# Altium schematic sheet PowerAmp.SchDoc
size A4; SheetNumber: 4; SheetTotal: 4
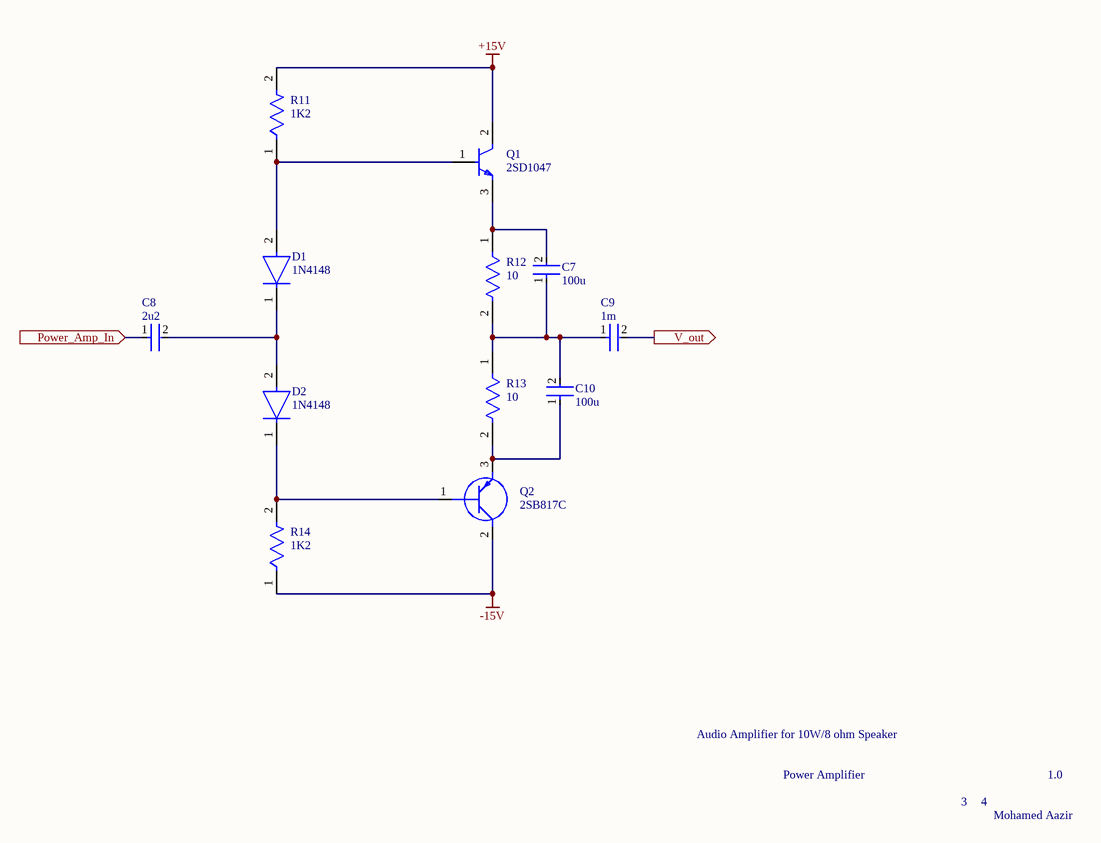
[diagram p0: PowerAmp.SchDoc]

## Parts
C7  100u  [FP-RAD-TH-D_5_0_5-L_11_1-MFG]
C8  2u2  [FP-RAD-TH-D_5_0_5-L_11_1-MFG]
C9  1m  [FP-RAD-TH-D_5_0_5-L_11_1-MFG]
C10  100u  [FP-RAD-TH-D_5_0_5-L_11_1-MFG]
D1  1N4148  [FP-017AG-MFG]
D2  1N4148  [FP-017AG-MFG]
Q1  2SD1047  [FP-2SD1047-MFG]
Q2  2SB817C  [TO545P500X1560X2380-3P]
R11  1K2  [FP-MFR-25-MFG]
R12  10  [FP-HVR37-MFG]
R13  10  [FP-HVR37-MFG]
R14  1K2  [FP-MFR-25-MFG]

## Ports
Power_Amp_In (in, see TopLevelDesign[2B], PreAmplifier_ToneController[4B]), V_out (out, see TopLevelDesign[3B], InputOutputPower[2B])

## Nets
+15V: Q1.2(C) R11.2
-15V: Q2.2(C) R14.1
Power_Amp_In: C8.1 ; port Power_Amp_In
V_out: C9.2 ; port V_out
NetC7_1: C7.1 C9.1 C10.2 R12.2 R13.1
NetC7_2: C7.2 Q1.3(E) R12.1
NetC8_2: C8.2 D1.1(C) D2.2(A)
NetC10_1: C10.1 Q2.3(E) R13.2
NetD1_2: D1.2(A) Q1.1(B) R11.1
NetD2_1: D2.1(C) Q2.1(B) R14.2

## Notes on the sheet
- Audio Amplifier for 10W/8 ohm Speaker
- Power Amplifier
- 3
- 4
- 1.0
- Mohamed Aazir

## Library data of the parts
C7-C10 = CMP-05427-002189-1: Aluminum Electrolytic Capacitors (Radial Lead Type) 22uF ±20% 25V; Dissipation Factor: 0.15%; Ripple Current: 60mA; Life (Hours): 2000Hour; Leakage Current: 3mA; Polarity: Bipolar; Lead Diameter: 0.5mm; Voltage Rating (DC): 25V; Capacitance: 22uF; Height: 11mm; Construction: RADIAL; Min Operating Temperature: -40°C; Tolerance: 20%; Max Operating Temperature: 85°C; Reach SVHC Compliant: Yes; Diameter: 5mm; Package Quantity: 200; Case/Package: Radial; Mount: Through Hole; Length: 11mm; Radiation Hardening: No; Size: 11mm; Height - Seated (Max): 0.433inch; Packaging: Bulk; Series: SU; Termination: Radial; Voltage: 25V; Voltage Rating: 25V; Lead Pitch: 2mm; RoHS Compliant: Yes; Lead Free: Lead Free
D1 D2 = CMP-07163-000046-1: DIODE GEN PURP 100V 200MA DO35; Forward Voltage: 1V; Max Power Dissipation: 500mW; Max Reverse Current: 5uA; Forward Current: 300mA; Current: 4A; Reverse Recovery Time: 4ns; Element Configuration: Single; Outside Diameter: 1.85mm; Capacitance: 4pF; Polarity: Standard; Max Forward Surge Current (Ifsm): 1A; Reverse Voltage: 100V; Output Current: 200mA; Average Rectified Current: 200mA; Diameter: 1.91mm; Max Repetitive Reverse Voltage (Vrrm): 100V; Current Rating: 200mA; Case/Package: DO-35; Lead Free: Lead Free; Number of Pins: 2; Recovery Time: 4ns; Packaging: Bulk; Contact Plating: Tin; Voltage: 100V; Mount: Through Hole; Max Surge Current: 4A; Package Quantity: 2000; Width: 1.91mm; Max Reverse Voltage (DC): 100V; Length: 4.56mm; Radiation Hardening: No; Power Dissipation: 500mW; Voltage Rating (DC): 100V; Peak Non-Repetitive Surge Current: 4A; REACH SVHC: No SVHC; Height: 4.56mm; Max Operating Temperature: 175°C; Series: -; Weight: 0.01lb; Min Operating Temperature: -65°C
Q1 = CMP-12195-000011-1: TRANS NPN 140V 12A TO-3P; Frequency: 20MHz; Max Power Dissipation: 100W; Collector-emitter Voltage-Max: 700mV; hFE Min: 50; Emitter Base Voltage (VEBO): 6V; Number of Elements: 1; Collector Base Voltage (VCBO): 200V; Min Operating Temperature: -65°C; Collector Emitter Voltage (VCEO): 140V; Transition Frequency: 20MHz; RoHS Compliant: Yes; Mount: Through Hole; Gain Bandwidth Product: 20MHz; Packaging: Rail/Tube; Contact Plating: Tin; Radiation Hardening: No; Polarity: NPN; Max Collector Current: 12A; REACH SVHC: No SVHC; Power Dissipation: 100W; Number of Pins: 3; Max Operating Temperature: 150°C; Package Quantity: 30; Lead Free: Lead Free; Series: -; Collector Emitter Breakdown Voltage: 140V
Q2 = 2SB817C: Transistor BJT PNP; Manufacturer_Name: onsemi; Datasheet Link: https://www.onsemi.com/pub/Collateral/ENA0188-D.PDF; Height: 5mm; Manufacturer_Part_Number: 2SB817C; Mouser Part Number: N/A; Mouser Price/Stock: https://www.mouser.co.uk/ProductDetail/ON-Semiconductor/2SB817C?qs=%252BEew9%252B0nqrC40L4G7JJ6Fg%3D%3D
R11 R14 = CMP-03413-000001-1: RES 1.18K OHM 1/4W 1% AXIAL; Manufacturer: Yageo; Manufacturer Part Number: MFR-25FBF52-1K18; Value: 1.18kΩ; Temperature Coefficient: 100ppm/°C; Power Rating: 0.25W; Voltage Rating: 250V; Temperature: -55°C to +155°C; Automotive: No; Temperature Range High: +155°C; Mouser Description: Metal Film Resistors 1.18K OHM 1/4W 1%; Digikey Description: RES 1.18K OHM 1/4W 1% AXIAL; Lead Free: Yes; Tolerance: 1%; ComponentLink2Description: Datasheet; ComponentLink2URL: https://www.yageo.com/upload/media/product/products/datasheet/lr/Yageo_LR_MFR_1.pdf; Temperature Range Low: -55°C; Package: MFR-25; Ipc Land Pattern Name: RESAD1000W75L680D260; Composition: Metal Film; Category: Res; Octopart: https://octopart.com/mfr-25fbf52-1k18-yageo-56251681; Series: MFR; Device Class L2: Resistors; Height: 2.6mm; Resistance: 1.18kΩ; Device Class L3: Through-Hole Resistors; RoHS: TRUE; Device Class L1: Passive Components
R12 R13 = CMP-00030-42845042-1: HVR3700001004FR500 Fixed Resistor, Metal Film, 0.5W, 1000000ohm, 3500V, 1% +/-Tol, 200ppm/Cel, Through Hole Mount; Resistance: 1MΩ; Voltage Rating: 3.5kV; Max Power Dissipation: 500mW; Lead Diameter: 780µm; Temperature Coefficient: 200ppm/°C; Number of Pins: 2; Composition: Metal Film; Features: Flame Retardant Coating; Schedule B: 8533210090, 8533210090; RoHS: Compliant; Voltage Rating (DC): 3.5kV; Min Operating Temperature: -55°C; REACH SVHC: Unknown; Tolerance: 1%; Termination: Axial; Radiation Hardening: No; Height: 4mm; Packaging: Cut Tape (CT); Length: 10.0076mm; Number of Terminations: 2; Max Operating Temperature: 155°C; Power Rating: 500mW; NexarPartId: 42845042; Lead Free: Lead Free; Case/Package: Axial